# Altium schematic sheet 电池模块_原理图.SchDoc
size A4
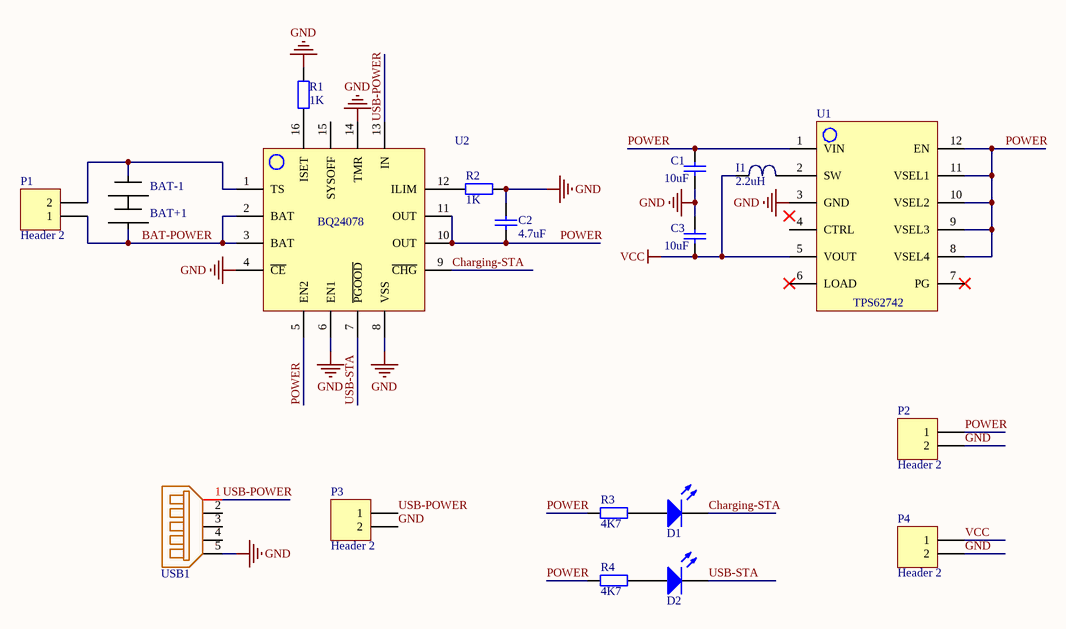
[diagram p0: 电池模块_原理图.SchDoc]

## Parts
BAT+1  BAT  [BAT+]  (value not drawn)
BAT-1  BAT  [BTA-]  (value not drawn)
C1  10uF  [1__0603-CAP_]
C2  4.7uF  [1__0603-CAP_]
C3  10uF  [1__0603-CAP_]
D1  LED  [1__0603-LED_]  (value not drawn)
D2  LED  [1__0603-LED_]  (value not drawn)
I1  2.2uH  [1__0805_IND]
P1  Header 2  [HDR1X2]
P2  Header 2  [HDR1X2]
P3  Header 2  [HDR1X2]
P4  Header 2  [HDR1X2]
R1  1K  [1__0603-RES_]
R2  1K  [1__0603-RES_]
R3  4K7  [1__0603-RES_]
R4  4K7  [1__0603-RES_]
U1  TPS62742  [TPS62742]
U2  BQ24078  [BQ24078]
USB1  USB-5P  [1__Micro USB 立贴_]  (value not drawn)

## Nets
GND: C1.1 C2.2 C3.2 P2.2 P3.2 P4.2 R1.1 R2.1 U1.3(GND) U2.4(~{CE}) U2.6(EN1) U2.8(VSS) U2.14(TMR) USB1.5(GND)
VCC: C3.1 I1.1 P4.1 U1.5(VOUT)
BAT-POWER: BAT+1.1 P1.1 U2.2(BAT) U2.3(BAT)
Charging-STA: D1.2 U2.9(~{CHG})
POWER: C1.2 C2.1 P2.1 R3.1 R4.1 U1.1(VIN) U1.8(VSEL4) U1.9(VSEL3) U1.10(VSEL2) U1.11(VSEL1) U1.12(EN) U2.5(EN2) U2.10(OUT) U2.11(OUT)
USB-POWER: P3.1 U2.13(IN) USB1.1(VBUS)
USB-STA: D2.2 U2.7(~{PGOOD})
NetBAT+1_2: BAT+1.2 BAT-1.1
NetBAT-1_2: BAT-1.2 P1.2 U2.1(TS)
NetD1_1: D1.1 R3.2
NetD2_1: D2.1 R4.2
NetI1_2: I1.2 U1.2(SW)
NetR1_2: R1.2 U2.16(ISET)
NetR2_2: R2.2 U2.12(ILIM)

Not connected (* = marked no-connect by the designer): U1 4(CTRL) 6(LOAD)* 7(PG)*; U2 15(SYSOFF); USB1 2(D-) 3(D+) 4(ID)

## Library data of the parts
C1-C3 = Cap: Capacitor; Value: 105
D1 D2 = LED0: Typical INFRARED GaAs LED
I1 = 电感: Value: 100uH
P1-P4 = Header 2: Header, 2-Pin; LatestRevisionDate: 17-Jul-2002; LatestRevisionNote: Re-released for DXP Platform.; Publisher: Altium Limited; Price(RMB): 0.00
R1 R2 = Res2: Resistor; Value: 4K7
R3 R4 = Res2: Resistor; Value: 4K7
U1 = TPS62742: 锂电池稳压
U2 = BQ24078: 充电芯片
USB1 = USB-5P: USB CONNECTOR